# EAGLE schematic PCB1 (EAGLE 9.3.1)

## Sheet 1 of 4: Light Sensor
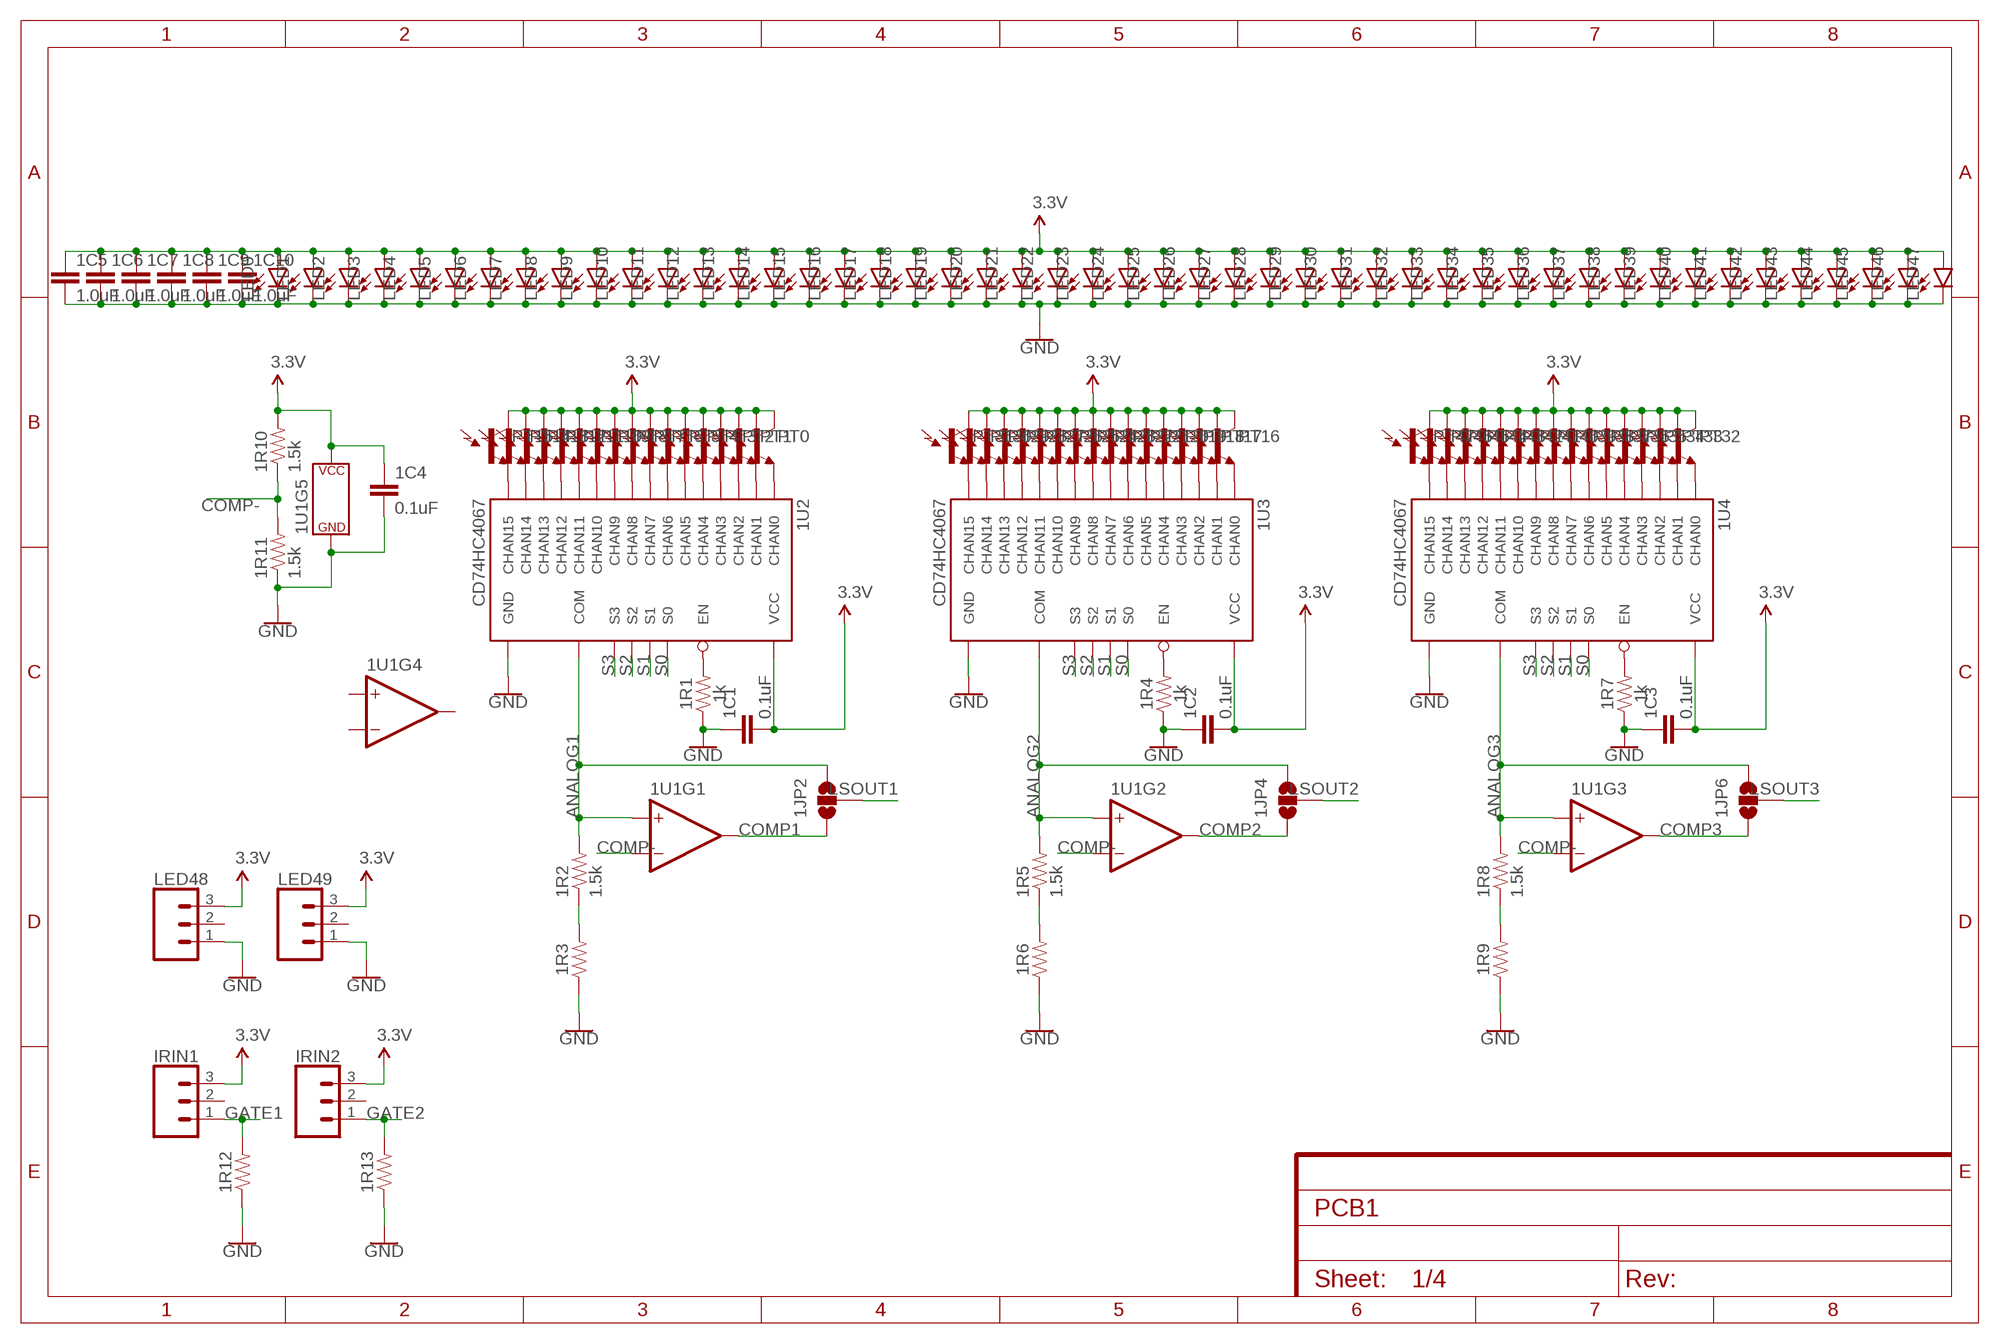
[diagram p0: schematic, sheet 1]

### Parts
1C1  0.1uF  0.1UF-0603-25V-5%  [0603]
1C2  0.1uF  0.1UF-0603-25V-5%  [0603]
1C3  0.1uF  0.1UF-0603-25V-5%  [0603]
1C4  0.1uF  0.1UF-0603-25V-5%  [0603]
1C5  1.0uF  1.0UF-0603-16V-10%-X7R  [0603]
1C6  1.0uF  1.0UF-0603-16V-10%-X7R  [0603]
1C7  1.0uF  1.0UF-0603-16V-10%-X7R  [0603]
1C8  1.0uF  1.0UF-0603-16V-10%-X7R  [0603]
1C9  1.0uF  1.0UF-0603-16V-10%-X7R  [0603]
1C10  1.0uF  1.0UF-0603-16V-10%-X7R  [0603]
1JP2  JUMPER-SMT_3_NO_NO_SILK  [SMT-JUMPER_3_0-NO_TRACE_NO-SILK]
1JP4  JUMPER-SMT_3_NO_NO_SILK  [SMT-JUMPER_3_0-NO_TRACE_NO-SILK]
1JP6  JUMPER-SMT_3_NO_NO_SILK  [SMT-JUMPER_3_0-NO_TRACE_NO-SILK]
1R1  1k  1KOHM-0603-1/10W-1%  [0603]
1R2  1.5k  1.5KOHM-0603-1/10W-1%  [0603]
1R3  RESISTOR0603  [0603]
1R4  1k  1KOHM-0603-1/10W-1%  [0603]
1R5  1.5k  1.5KOHM-0603-1/10W-1%  [0603]
1R6  RESISTOR0603  [0603]
1R7  1k  1KOHM-0603-1/10W-1%  [0603]
1R8  1.5k  1.5KOHM-0603-1/10W-1%  [0603]
1R9  RESISTOR0603  [0603]
1R10  1.5k  1.5KOHM-0603-1/10W-1%  [0603]
1R11  1.5k  1.5KOHM-0603-1/10W-1%  [0603]
1R12  RESISTOR0603  [0603]
1R13  RESISTOR0603  [0603]
1U1  LM339  [SOIC-14]
1U2  CD74HC4067  [SOIC-24]
1U3  CD74HC4067  [SOIC-24]
1U4  CD74HC4067  [SOIC-24]
IRIN1  CONN_03  [1X03]
IRIN2  CONN_03  [1X03]
LED0  3528LED  [3528]
LED1  3528LED  [3528]
LED2  3528LED  [3528]
LED3  3528LED  [3528]
LED4  3528LED  [3528]
LED5  3528LED  [3528]
LED6  3528LED  [3528]
LED7  3528LED  [3528]
LED8  3528LED  [3528]
LED9  3528LED  [3528]
LED10  3528LED  [3528]
LED11  3528LED  [3528]
LED12  3528LED  [3528]
LED13  3528LED  [3528]
LED14  3528LED  [3528]
LED15  3528LED  [3528]
LED16  3528LED  [3528]
LED17  3528LED  [3528]
LED18  3528LED  [3528]
LED19  3528LED  [3528]
LED20  3528LED  [3528]
LED21  3528LED  [3528]
LED22  3528LED  [3528]
LED23  3528LED  [3528]
LED24  3528LED  [3528]
LED25  3528LED  [3528]
LED26  3528LED  [3528]
LED27  3528LED  [3528]
LED28  3528LED  [3528]
LED29  3528LED  [3528]
LED30  3528LED  [3528]
LED31  3528LED  [3528]
LED32  3528LED  [3528]
LED33  3528LED  [3528]
LED34  3528LED  [3528]
LED35  3528LED  [3528]
LED36  3528LED  [3528]
LED37  3528LED  [3528]
LED38  3528LED  [3528]
LED39  3528LED  [3528]
LED40  3528LED  [3528]
LED41  3528LED  [3528]
LED42  3528LED  [3528]
LED43  3528LED  [3528]
LED44  3528LED  [3528]
LED45  3528LED  [3528]
LED46  3528LED  [3528]
LED47  3528LED  [3528]
LED48  CONN_03  [1X03]
LED49  CONN_03  [1X03]
PT0  TEMT6000  LIGHT_SENSORTEMT6000  [TEMT6000]
PT1  TEMT6000  LIGHT_SENSORTEMT6000  [TEMT6000]
PT2  TEMT6000  LIGHT_SENSORTEMT6000  [TEMT6000]
PT3  TEMT6000  LIGHT_SENSORTEMT6000  [TEMT6000]
PT4  TEMT6000  LIGHT_SENSORTEMT6000  [TEMT6000]
PT5  TEMT6000  LIGHT_SENSORTEMT6000  [TEMT6000]
PT6  TEMT6000  LIGHT_SENSORTEMT6000  [TEMT6000]
PT7  TEMT6000  LIGHT_SENSORTEMT6000  [TEMT6000]
PT8  TEMT6000  LIGHT_SENSORTEMT6000  [TEMT6000]
PT9  TEMT6000  LIGHT_SENSORTEMT6000  [TEMT6000]
PT10  TEMT6000  LIGHT_SENSORTEMT6000  [TEMT6000]
PT11  TEMT6000  LIGHT_SENSORTEMT6000  [TEMT6000]
PT12  TEMT6000  LIGHT_SENSORTEMT6000  [TEMT6000]
PT13  TEMT6000  LIGHT_SENSORTEMT6000  [TEMT6000]
PT14  TEMT6000  LIGHT_SENSORTEMT6000  [TEMT6000]
PT15  TEMT6000  LIGHT_SENSORTEMT6000  [TEMT6000]
PT16  TEMT6000  LIGHT_SENSORTEMT6000  [TEMT6000]
PT17  TEMT6000  LIGHT_SENSORTEMT6000  [TEMT6000]
PT18  TEMT6000  LIGHT_SENSORTEMT6000  [TEMT6000]
PT19  TEMT6000  LIGHT_SENSORTEMT6000  [TEMT6000]
PT20  TEMT6000  LIGHT_SENSORTEMT6000  [TEMT6000]
PT21  TEMT6000  LIGHT_SENSORTEMT6000  [TEMT6000]
PT22  TEMT6000  LIGHT_SENSORTEMT6000  [TEMT6000]
PT23  TEMT6000  LIGHT_SENSORTEMT6000  [TEMT6000]
PT24  TEMT6000  LIGHT_SENSORTEMT6000  [TEMT6000]
PT25  TEMT6000  LIGHT_SENSORTEMT6000  [TEMT6000]
PT26  TEMT6000  LIGHT_SENSORTEMT6000  [TEMT6000]
PT27  TEMT6000  LIGHT_SENSORTEMT6000  [TEMT6000]
PT28  TEMT6000  LIGHT_SENSORTEMT6000  [TEMT6000]
PT29  TEMT6000  LIGHT_SENSORTEMT6000  [TEMT6000]
PT30  TEMT6000  LIGHT_SENSORTEMT6000  [TEMT6000]
PT31  TEMT6000  LIGHT_SENSORTEMT6000  [TEMT6000]
PT32  TEMT6000  LIGHT_SENSORTEMT6000  [TEMT6000]
PT33  TEMT6000  LIGHT_SENSORTEMT6000  [TEMT6000]
PT34  TEMT6000  LIGHT_SENSORTEMT6000  [TEMT6000]
PT35  TEMT6000  LIGHT_SENSORTEMT6000  [TEMT6000]
PT36  TEMT6000  LIGHT_SENSORTEMT6000  [TEMT6000]
PT37  TEMT6000  LIGHT_SENSORTEMT6000  [TEMT6000]
PT38  TEMT6000  LIGHT_SENSORTEMT6000  [TEMT6000]
PT39  TEMT6000  LIGHT_SENSORTEMT6000  [TEMT6000]
PT40  TEMT6000  LIGHT_SENSORTEMT6000  [TEMT6000]
PT41  TEMT6000  LIGHT_SENSORTEMT6000  [TEMT6000]
PT42  TEMT6000  LIGHT_SENSORTEMT6000  [TEMT6000]
PT43  TEMT6000  LIGHT_SENSORTEMT6000  [TEMT6000]
PT44  TEMT6000  LIGHT_SENSORTEMT6000  [TEMT6000]
PT45  TEMT6000  LIGHT_SENSORTEMT6000  [TEMT6000]
PT46  TEMT6000  LIGHT_SENSORTEMT6000  [TEMT6000]
PT47  TEMT6000  LIGHT_SENSORTEMT6000  [TEMT6000]

### Nets
3.3V: 1C1.2 1C2.2 1C3.2 1C4.1 1C5.1 1C6.1 1C7.1 1C8.1 1C9.1 1C10.1 1R10.2 1U1.P3(P$V+) 1U2.P24(VCC) 1U3.P24(VCC) 1U4.P24(VCC) IRIN1.3 IRIN2.3 LED0.A LED1.A LED2.A LED3.A LED4.A LED5.A LED6.A LED7.A LED8.A LED9.A LED10.A LED11.A LED12.A LED13.A LED14.A LED15.A LED16.A LED17.A LED18.A LED19.A LED20.A LED21.A LED22.A LED23.A LED24.A LED25.A LED26.A LED27.A LED28.A LED29.A LED30.A LED31.A LED32.A LED33.A LED34.A LED35.A LED36.A LED37.A LED38.A LED39.A LED40.A LED41.A LED42.A LED43.A LED44.A LED45.A LED46.A LED47.A LED48.3 LED49.3 PT0.COLLECTOR(C1) PT1.COLLECTOR(C1) PT2.COLLECTOR(C1) PT3.COLLECTOR(C1) PT4.COLLECTOR(C1) PT5.COLLECTOR(C1) PT6.COLLECTOR(C1) PT7.COLLECTOR(C1) PT8.COLLECTOR(C1) PT9.COLLECTOR(C1) PT10.COLLECTOR(C1) PT11.COLLECTOR(C1) PT12.COLLECTOR(C1) PT13.COLLECTOR(C1) PT14.COLLECTOR(C1) PT15.COLLECTOR(C1) PT16.COLLECTOR(C1) PT17.COLLECTOR(C1) PT18.COLLECTOR(C1) PT19.COLLECTOR(C1) PT20.COLLECTOR(C1) PT21.COLLECTOR(C1) PT22.COLLECTOR(C1) PT23.COLLECTOR(C1) PT24.COLLECTOR(C1) PT25.COLLECTOR(C1) PT26.COLLECTOR(C1) PT27.COLLECTOR(C1) PT28.COLLECTOR(C1) PT29.COLLECTOR(C1) PT30.COLLECTOR(C1) PT31.COLLECTOR(C1) PT32.COLLECTOR(C1) PT33.COLLECTOR(C1) PT34.COLLECTOR(C1) PT35.COLLECTOR(C1) PT36.COLLECTOR(C1) PT37.COLLECTOR(C1) PT38.COLLECTOR(C1) PT39.COLLECTOR(C1) PT40.COLLECTOR(C1) PT41.COLLECTOR(C1) PT42.COLLECTOR(C1) PT43.COLLECTOR(C1) PT44.COLLECTOR(C1) PT45.COLLECTOR(C1) PT46.COLLECTOR(C1) PT47.COLLECTOR(C1) ; also sheet 2,3,4
ANALOG1: 1JP2.3 1R2.2 1U1.P5(+IN) 1U2.P1(COM)
ANALOG2: 1JP4.3 1R5.2 1U1.P7(+IN) 1U3.P1(COM)
ANALOG3: 1JP6.3 1R8.2 1U1.P9(+IN) 1U4.P1(COM)
COMP1: 1JP2.1 1U1.P2(OUT)
COMP2: 1JP4.1 1U1.P1(OUT)
COMP3: 1JP6.1 1U1.P14(OUT)
COMP-: 1R10.1 1R11.2 1U1.P4(-IN) 1U1.P6(-IN) 1U1.P8(-IN)
GATE1: 1R12.2 IRIN1.1 ; also sheet 4
GATE2: 1R13.2 IRIN2.1 ; also sheet 4
GND: 1C1.1 1C2.1 1C3.1 1C4.2 1C5.2 1C6.2 1C7.2 1C8.2 1C9.2 1C10.2 1R1.1 1R3.1 1R4.1 1R6.1 1R7.1 1R9.1 1R11.1 1R12.1 1R13.1 1U1.P12(P$V-) 1U2.P12(GND) 1U3.P12(GND) 1U4.P12(GND) LED0.C LED1.C LED2.C LED3.C LED4.C LED5.C LED6.C LED7.C LED8.C LED9.C LED10.C LED11.C LED12.C LED13.C LED14.C LED15.C LED16.C LED17.C LED18.C LED19.C LED20.C LED21.C LED22.C LED23.C LED24.C LED25.C LED26.C LED27.C LED28.C LED29.C LED30.C LED31.C LED32.C LED33.C LED34.C LED35.C LED36.C LED37.C LED38.C LED39.C LED40.C LED41.C LED42.C LED43.C LED44.C LED45.C LED46.C LED47.C LED48.1 LED49.1 ; also sheet 2,3,4
LSOUT1: 1JP2.2 ; also sheet 4
LSOUT2: 1JP4.2 ; also sheet 4
LSOUT3: 1JP6.2 ; also sheet 4
N$1: 1U2.P9(CHAN0) PT0.EMITTER(E1)
N$50: 1R1.2 1U2.P15(EN)
N$51: 1U2.P8(CHAN1) PT1.EMITTER(E1)
N$52: 1U2.P7(CHAN2) PT2.EMITTER(E1)
N$53: 1U2.P6(CHAN3) PT3.EMITTER(E1)
N$54: 1U2.P5(CHAN4) PT4.EMITTER(E1)
N$55: 1U2.P4(CHAN5) PT5.EMITTER(E1)
N$56: 1U2.P3(CHAN6) PT6.EMITTER(E1)
N$57: 1U2.P2(CHAN7) PT7.EMITTER(E1)
N$58: 1U2.P23(CHAN8) PT8.EMITTER(E1)
N$59: 1U2.P22(CHAN9) PT9.EMITTER(E1)
N$60: 1U2.P21(CHAN10) PT10.EMITTER(E1)
N$61: 1U2.P20(CHAN11) PT11.EMITTER(E1)
N$62: 1U2.P19(CHAN12) PT12.EMITTER(E1)
N$63: 1U2.P18(CHAN13) PT13.EMITTER(E1)
N$64: 1U2.P17(CHAN14) PT14.EMITTER(E1)
N$65: 1U2.P16(CHAN15) PT15.EMITTER(E1)
N$66: 1R4.2 1U3.P15(EN)
N$67: 1R2.1 1R3.2
N$68: 1U3.P9(CHAN0) PT16.EMITTER(E1)
N$69: 1U3.P8(CHAN1) PT17.EMITTER(E1)
N$70: 1R5.1 1R6.2
N$71: 1U3.P7(CHAN2) PT18.EMITTER(E1)
N$72: 1U3.P6(CHAN3) PT19.EMITTER(E1)
N$73: 1U3.P5(CHAN4) PT20.EMITTER(E1)
N$74: 1U3.P4(CHAN5) PT21.EMITTER(E1)
N$75: 1U3.P3(CHAN6) PT22.EMITTER(E1)
N$76: 1U3.P2(CHAN7) PT23.EMITTER(E1)
N$77: 1U3.P23(CHAN8) PT24.EMITTER(E1)
N$78: 1U3.P22(CHAN9) PT25.EMITTER(E1)
N$79: 1U3.P21(CHAN10) PT26.EMITTER(E1)
N$80: 1U3.P20(CHAN11) PT27.EMITTER(E1)
N$81: 1U3.P19(CHAN12) PT28.EMITTER(E1)
N$82: 1U3.P18(CHAN13) PT29.EMITTER(E1)
N$83: 1U3.P17(CHAN14) PT30.EMITTER(E1)
N$84: 1U3.P16(CHAN15) PT31.EMITTER(E1)
N$85: 1U4.P9(CHAN0) PT32.EMITTER(E1)
N$86: 1U4.P8(CHAN1) PT33.EMITTER(E1)
N$87: 1R7.2 1U4.P15(EN)
N$88: 1R8.1 1R9.2
N$89: 1U4.P7(CHAN2) PT34.EMITTER(E1)
N$90: 1U4.P6(CHAN3) PT35.EMITTER(E1)
N$91: 1U4.P5(CHAN4) PT36.EMITTER(E1)
N$92: 1U4.P4(CHAN5) PT37.EMITTER(E1)
N$93: 1U4.P3(CHAN6) PT38.EMITTER(E1)
N$94: 1U4.P2(CHAN7) PT39.EMITTER(E1)
N$95: 1U4.P23(CHAN8) PT40.EMITTER(E1)
N$96: 1U4.P22(CHAN9) PT41.EMITTER(E1)
N$97: 1U4.P21(CHAN10) PT42.EMITTER(E1)
N$98: 1U4.P20(CHAN11) PT43.EMITTER(E1)
N$99: 1U4.P19(CHAN12) PT44.EMITTER(E1)
N$100: 1U4.P18(CHAN13) PT45.EMITTER(E1)
N$101: 1U4.P17(CHAN14) PT46.EMITTER(E1)
N$102: 1U4.P16(CHAN15) PT47.EMITTER(E1)
S0: 1U2.P10(S0) 1U3.P10(S0) 1U4.P10(S0) ; also sheet 4
S1: 1U2.P11(S1) 1U3.P11(S1) 1U4.P11(S1) ; also sheet 4
S2: 1U2.P14(S2) 1U3.P14(S2) 1U4.P14(S2) ; also sheet 4
S3: 1U2.P13(S3) 1U3.P13(S3) 1U4.P13(S3) ; also sheet 4
Unconnected: 1U1.P10(-IN) 1U1.P11(+IN) 1U1.P13(OUT) IRIN1.2 IRIN2.2 LED48.2 LED49.2

## Sheet 2 of 4: Motor Driver
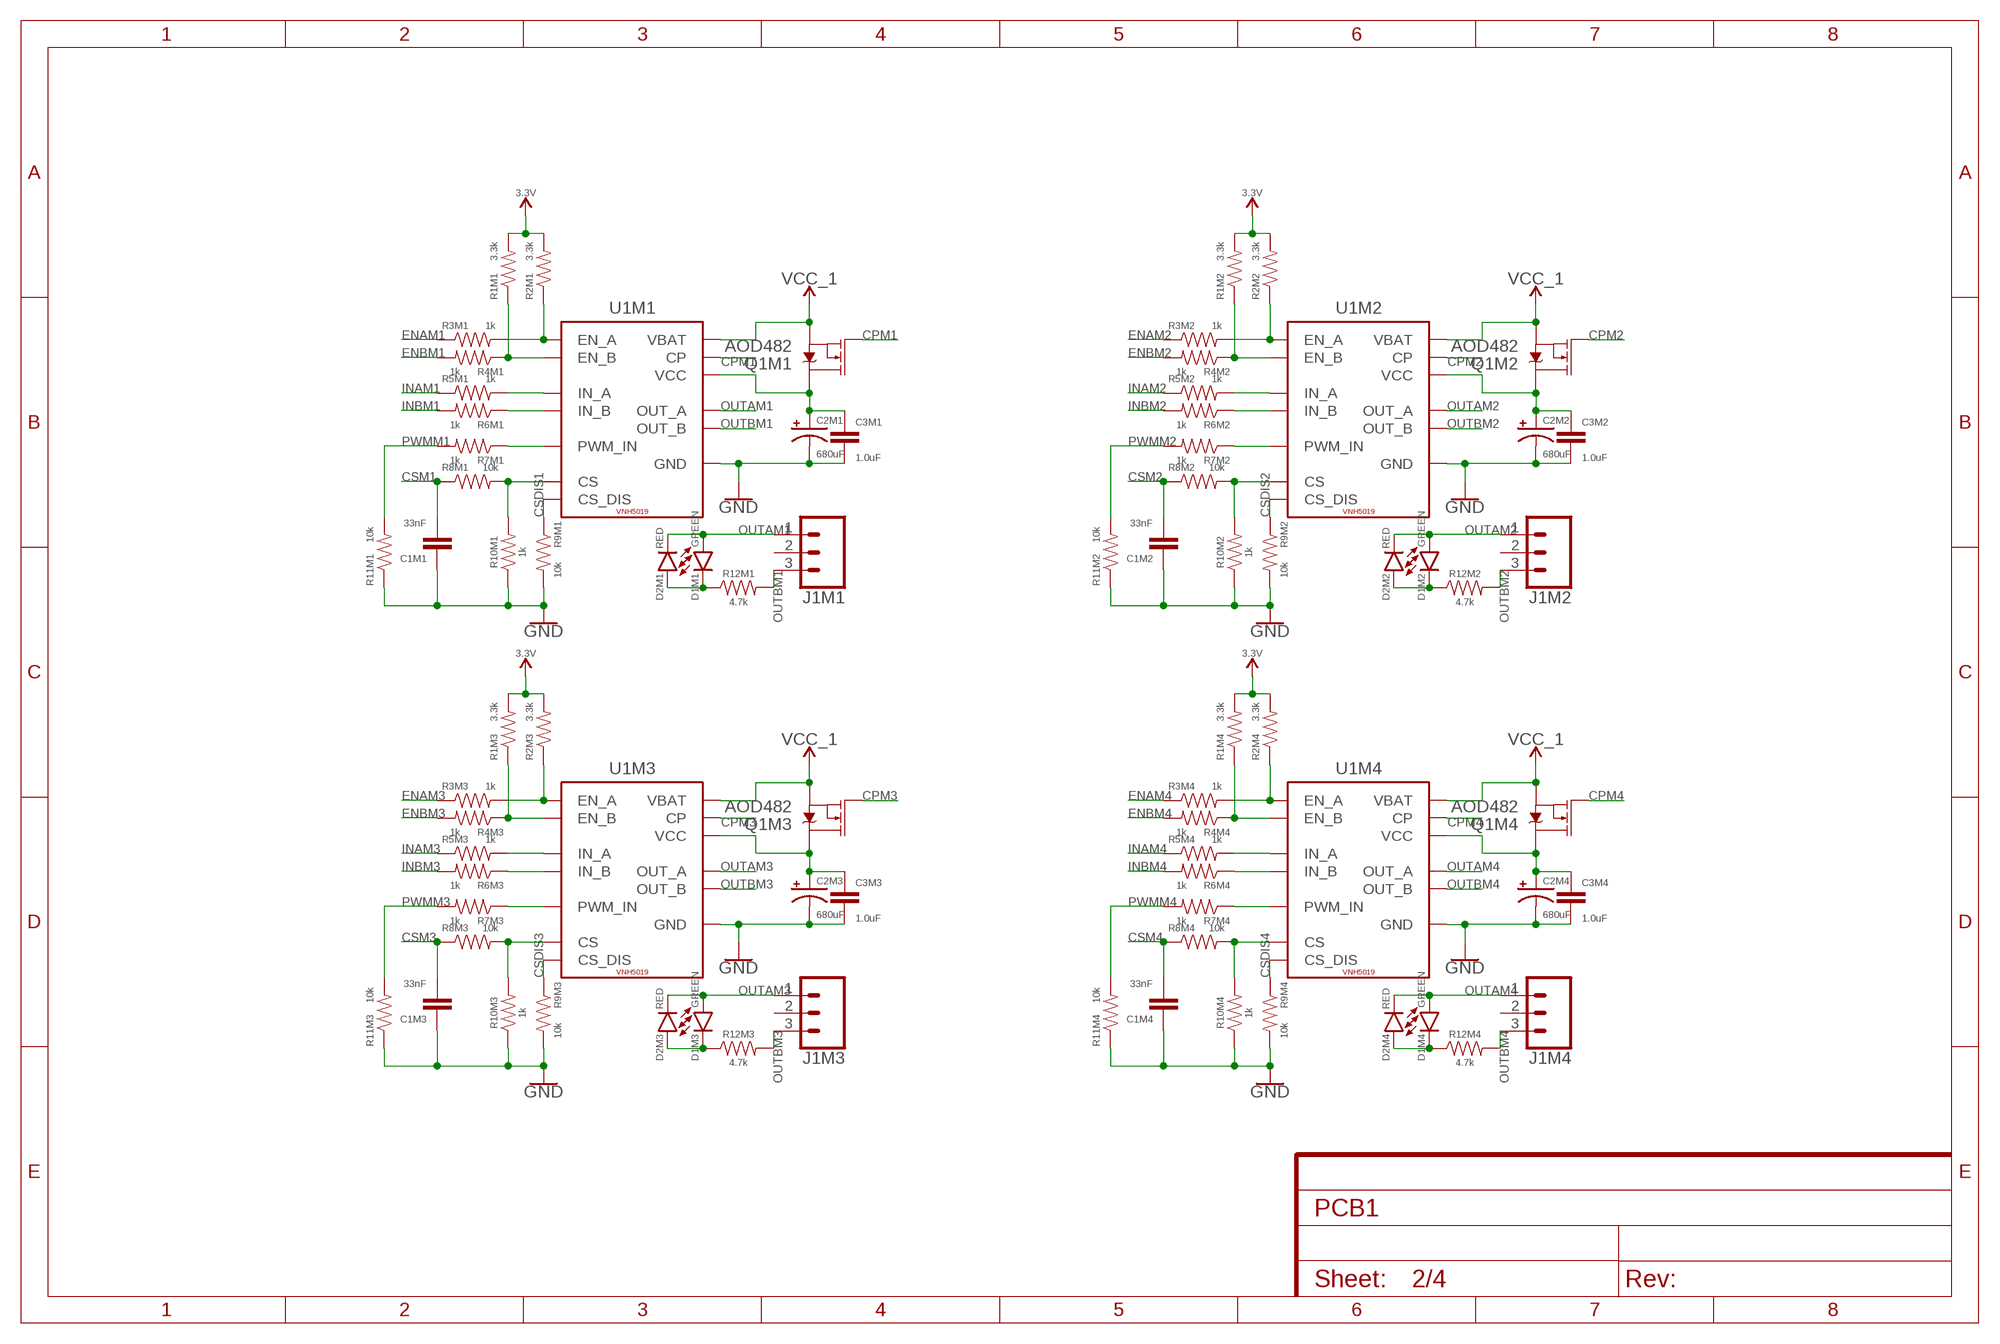
[diagram p1: schematic, sheet 2]

### Parts
C1M1  33nF  33NF-0603-50V-10%  [0603]
C1M2  33nF  33NF-0603-50V-10%  [0603]
C1M3  33nF  33NF-0603-50V-10%  [0603]
C1M4  33nF  33NF-0603-50V-10%  [0603]
C2M1  680uF  CPOL-USE3.5-8  [E3,5-8]
C2M2  680uF  CPOL-USE3.5-8  [E3,5-8]
C2M3  680uF  CPOL-USE3.5-8  [E3,5-8]
C2M4  680uF  CPOL-USE3.5-8  [E3,5-8]
C3M1  1.0uF  1.0UF-0603-16V-10%-X7R  [0603]
C3M2  1.0uF  1.0UF-0603-16V-10%-X7R  [0603]
C3M3  1.0uF  1.0UF-0603-16V-10%-X7R  [0603]
C3M4  1.0uF  1.0UF-0603-16V-10%-X7R  [0603]
D1M1  GREEN  LED-GREEN0603  [LED-0603]
D1M2  GREEN  LED-GREEN0603  [LED-0603]
D1M3  GREEN  LED-GREEN0603  [LED-0603]
D1M4  GREEN  LED-GREEN0603  [LED-0603]
D2M1  RED  LED-RED0603  [LED-0603]
D2M2  RED  LED-RED0603  [LED-0603]
D2M3  RED  LED-RED0603  [LED-0603]
D2M4  RED  LED-RED0603  [LED-0603]
J1M1  CONN_03-SCREW-5MM  [SCREWTERMINAL-5MM-3]
J1M2  CONN_03-SCREW-5MM  [SCREWTERMINAL-5MM-3]
J1M3  CONN_03-SCREW-5MM  [SCREWTERMINAL-5MM-3]
J1M4  CONN_03-SCREW-5MM  [SCREWTERMINAL-5MM-3]
Q1M1  AOD482  MOSFET-NCH-FDD8780  [DPAK]
Q1M2  AOD482  MOSFET-NCH-FDD8780  [DPAK]
Q1M3  AOD482  MOSFET-NCH-FDD8780  [DPAK]
Q1M4  AOD482  MOSFET-NCH-FDD8780  [DPAK]
R1M1  3.3k  3.3KOHM-0603-1/10W-1%  [0603]
R1M2  3.3k  3.3KOHM-0603-1/10W-1%  [0603]
R1M3  3.3k  3.3KOHM-0603-1/10W-1%  [0603]
R1M4  3.3k  3.3KOHM-0603-1/10W-1%  [0603]
R2M1  3.3k  3.3KOHM-0603-1/10W-1%  [0603]
R2M2  3.3k  3.3KOHM-0603-1/10W-1%  [0603]
R2M3  3.3k  3.3KOHM-0603-1/10W-1%  [0603]
R2M4  3.3k  3.3KOHM-0603-1/10W-1%  [0603]
R3M1  1k  1KOHM-0603-1/10W-1%  [0603]
R3M2  1k  1KOHM-0603-1/10W-1%  [0603]
R3M3  1k  1KOHM-0603-1/10W-1%  [0603]
R3M4  1k  1KOHM-0603-1/10W-1%  [0603]
R4M1  1k  1KOHM-0603-1/10W-1%  [0603]
R4M2  1k  1KOHM-0603-1/10W-1%  [0603]
R4M3  1k  1KOHM-0603-1/10W-1%  [0603]
R4M4  1k  1KOHM-0603-1/10W-1%  [0603]
R5M1  1k  1KOHM-0603-1/10W-1%  [0603]
R5M2  1k  1KOHM-0603-1/10W-1%  [0603]
R5M3  1k  1KOHM-0603-1/10W-1%  [0603]
R5M4  1k  1KOHM-0603-1/10W-1%  [0603]
R6M1  1k  1KOHM-0603-1/10W-1%  [0603]
R6M2  1k  1KOHM-0603-1/10W-1%  [0603]
R6M3  1k  1KOHM-0603-1/10W-1%  [0603]
R6M4  1k  1KOHM-0603-1/10W-1%  [0603]
R7M1  1k  1KOHM-0603-1/10W-1%  [0603]
R7M2  1k  1KOHM-0603-1/10W-1%  [0603]
R7M3  1k  1KOHM-0603-1/10W-1%  [0603]
R7M4  1k  1KOHM-0603-1/10W-1%  [0603]
R8M1  10k  10KOHM-0603-1/10W-1%  [0603]
R8M2  10k  10KOHM-0603-1/10W-1%  [0603]
R8M3  10k  10KOHM-0603-1/10W-1%  [0603]
R8M4  10k  10KOHM-0603-1/10W-1%  [0603]
R9M1  10k  10KOHM-0603-1/10W-1%  [0603]
R9M2  10k  10KOHM-0603-1/10W-1%  [0603]
R9M3  10k  10KOHM-0603-1/10W-1%  [0603]
R9M4  10k  10KOHM-0603-1/10W-1%  [0603]
R10M1  1k  1KOHM-0603-1/10W-1%  [0603]
R10M2  1k  1KOHM-0603-1/10W-1%  [0603]
R10M3  1k  1KOHM-0603-1/10W-1%  [0603]
R10M4  1k  1KOHM-0603-1/10W-1%  [0603]
R11M1  10k  10KOHM-0603-1/10W-1%  [0603]
R11M2  10k  10KOHM-0603-1/10W-1%  [0603]
R11M3  10k  10KOHM-0603-1/10W-1%  [0603]
R11M4  10k  10KOHM-0603-1/10W-1%  [0603]
R12M1  4.7k  4.7KOHM-0603-1/10W-1%  [0603]
R12M2  4.7k  4.7KOHM-0603-1/10W-1%  [0603]
R12M3  4.7k  4.7KOHM-0603-1/10W-1%  [0603]
R12M4  4.7k  4.7KOHM-0603-1/10W-1%  [0603]
U1M1  VNH5019  [POWERSO-30]
U1M2  VNH5019  [POWERSO-30]
U1M3  VNH5019  [POWERSO-30]
U1M4  VNH5019  [POWERSO-30]

### Nets
3.3V: R1M1.2 R1M2.2 R1M3.2 R1M4.2 R2M1.2 R2M2.2 R2M3.2 R2M4.2 ; also sheet 1,3,4
CPM1: Q1M1.1(G) U1M1.P11(CP)
CPM2: Q1M2.1(G) U1M2.P11(CP)
CPM3: Q1M3.1(G) U1M3.P11(CP)
CPM4: Q1M4.1(G) U1M4.P11(CP)
CSDIS1: R9M1.1 U1M1.P6(CS_DIS)
CSDIS2: R9M2.1 U1M2.P6(CS_DIS)
CSDIS3: R9M3.1 U1M3.P6(CS_DIS)
CSDIS4: R9M4.1 U1M4.P6(CS_DIS)
CSM1: C1M1.2 R8M1.1 ; also sheet 4
CSM2: C1M2.2 R8M2.1 ; also sheet 4
CSM3: C1M3.2 R8M3.1 ; also sheet 4
CSM4: C1M4.2 R8M4.1 ; also sheet 4
ENAM1: R3M1.1
ENAM2: R3M2.1
ENAM3: R3M3.1
ENAM4: R3M4.1
ENBM1: R4M1.2
ENBM2: R4M2.2
ENBM3: R4M3.2
ENBM4: R4M4.2
GND: C1M1.1 C1M2.1 C1M3.1 C1M4.1 C2M1.- C2M2.- C2M3.- C2M4.- C3M1.2 C3M2.2 C3M3.2 C3M4.2 R9M1.2 R9M2.2 R9M3.2 R9M4.2 R10M1.1 R10M2.1 R10M3.1 R10M4.1 R11M1.1 R11M2.1 R11M3.1 R11M4.1 U1M1.P18(GND) U1M1.P19(GND) U1M1.P20(GND) U1M1.P26(GND) U1M1.P27(GND) U1M1.P28(GND) U1M2.P18(GND) U1M2.P19(GND) U1M2.P20(GND) U1M2.P26(GND) U1M2.P27(GND) U1M2.P28(GND) U1M3.P18(GND) U1M3.P19(GND) U1M3.P20(GND) U1M3.P26(GND) U1M3.P27(GND) U1M3.P28(GND) U1M4.P18(GND) U1M4.P19(GND) U1M4.P20(GND) U1M4.P26(GND) U1M4.P27(GND) U1M4.P28(GND) ; also sheet 1,3,4
INAM1: R5M1.1 ; also sheet 4
INAM2: R5M2.1 ; also sheet 4
INAM3: R5M3.1 ; also sheet 4
INAM4: R5M4.1 ; also sheet 4
INBM1: R6M1.2 ; also sheet 4
INBM2: R6M2.2 ; also sheet 4
INBM3: R6M3.2 ; also sheet 4
INBM4: R6M4.2 ; also sheet 4
N$2: R2M1.1 R3M1.2 U1M1.P5(EN_A)
N$3: C2M1.+ C3M1.1 Q1M1.4(D) U1M1.P3(VCC) U1M1.P13(VCC) U1M1.P23(VCC) U1M1.SLUG1(VCC)
N$4: R1M1.1 R4M1.1 U1M1.P9(EN_B)
N$5: R6M1.1 U1M1.P10(IN_B)
N$6: R5M1.2 U1M1.P4(IN_A)
N$7: R8M1.2 R10M1.2 U1M1.P8(CS)
N$8: R7M1.1 U1M1.P7(PWM_IN)
N$9: C2M2.+ C3M2.1 Q1M2.4(D) U1M2.P3(VCC) U1M2.P13(VCC) U1M2.P23(VCC) U1M2.SLUG1(VCC)
N$10: R2M2.1 R3M2.2 U1M2.P5(EN_A)
N$11: R5M2.2 U1M2.P4(IN_A)
N$12: D1M1.C D2M1.A R12M1.1
N$13: R1M2.1 R4M2.1 U1M2.P9(EN_B)
N$14: R6M2.1 U1M2.P10(IN_B)
N$15: R8M2.2 R10M2.2 U1M2.P8(CS)
N$16: R7M2.1 U1M2.P7(PWM_IN)
N$17: D1M2.C D2M2.A R12M2.1
N$18: C2M3.+ C3M3.1 Q1M3.4(D) U1M3.P3(VCC) U1M3.P13(VCC) U1M3.P23(VCC) U1M3.SLUG1(VCC)
N$19: R2M3.1 R3M3.2 U1M3.P5(EN_A)
N$20: R5M3.2 U1M3.P4(IN_A)
N$21: R1M3.1 R4M3.1 U1M3.P9(EN_B)
N$22: R6M3.1 U1M3.P10(IN_B)
N$23: R8M3.2 R10M3.2 U1M3.P8(CS)
N$24: R7M3.1 U1M3.P7(PWM_IN)
N$25: D1M3.C D2M3.A R12M3.1
N$26: C2M4.+ C3M4.1 Q1M4.4(D) U1M4.P3(VCC) U1M4.P13(VCC) U1M4.P23(VCC) U1M4.SLUG1(VCC)
N$27: R2M4.1 R3M4.2 U1M4.P5(EN_A)
N$28: R5M4.2 U1M4.P4(IN_A)
N$29: R1M4.1 R4M4.1 U1M4.P9(EN_B)
N$30: R6M4.1 U1M4.P10(IN_B)
N$31: R8M4.2 R10M4.2 U1M4.P8(CS)
N$32: R7M4.1 U1M4.P7(PWM_IN)
N$33: D1M4.C D2M4.A R12M4.1
OUTAM1: D1M1.A D2M1.C J1M1.1 U1M1.P1(OUT_A) U1M1.P25(OUT_A) U1M1.P30(OUT_A) U1M1.SLUG2(OUT_A)
OUTAM2: D1M2.A D2M2.C J1M2.1 U1M2.P1(OUT_A) U1M2.P25(OUT_A) U1M2.P30(OUT_A) U1M2.SLUG2(OUT_A)
OUTAM3: D1M3.A D2M3.C J1M3.1 U1M3.P1(OUT_A) U1M3.P25(OUT_A) U1M3.P30(OUT_A) U1M3.SLUG2(OUT_A)
OUTAM4: D1M4.A D2M4.C J1M4.1 U1M4.P1(OUT_A) U1M4.P25(OUT_A) U1M4.P30(OUT_A) U1M4.SLUG2(OUT_A)
OUTBM1: J1M1.3 R12M1.2 U1M1.P15(OUT_B) U1M1.P16(OUT_B) U1M1.P21(OUT_B) U1M1.SLUG3(OUT_B)
OUTBM2: J1M2.3 R12M2.2 U1M2.P15(OUT_B) U1M2.P16(OUT_B) U1M2.P21(OUT_B) U1M2.SLUG3(OUT_B)
OUTBM3: J1M3.3 R12M3.2 U1M3.P15(OUT_B) U1M3.P16(OUT_B) U1M3.P21(OUT_B) U1M3.SLUG3(OUT_B)
OUTBM4: J1M4.3 R12M4.2 U1M4.P15(OUT_B) U1M4.P16(OUT_B) U1M4.P21(OUT_B) U1M4.SLUG3(OUT_B)
PWMM1: R7M1.2 R11M1.2 ; also sheet 4
PWMM2: R7M2.2 R11M2.2 ; also sheet 4
PWMM3: R7M3.2 R11M3.2 ; also sheet 4
PWMM4: R7M4.2 R11M4.2 ; also sheet 4
VCC_1: Q1M1.3(S) Q1M2.3(S) Q1M3.3(S) Q1M4.3(S) U1M1.P12(VBAT) U1M2.P12(VBAT) U1M3.P12(VBAT) U1M4.P12(VBAT) ; also sheet 4
Unconnected: J1M1.2 J1M2.2 J1M3.2 J1M4.2 U1M1.P2(NC) U1M1.P14(NC) U1M1.P17(NC) U1M1.P22(NC) U1M1.P24(NC) U1M1.P29(NC) U1M2.P2(NC) U1M2.P14(NC) U1M2.P17(NC) U1M2.P22(NC) U1M2.P24(NC) U1M2.P29(NC) U1M3.P2(NC) U1M3.P14(NC) U1M3.P17(NC) U1M3.P22(NC) U1M3.P24(NC) U1M3.P29(NC) U1M4.P2(NC) U1M4.P14(NC) U1M4.P17(NC) U1M4.P22(NC) U1M4.P24(NC) U1M4.P29(NC)

## Sheet 3 of 4: Boost & Step Down
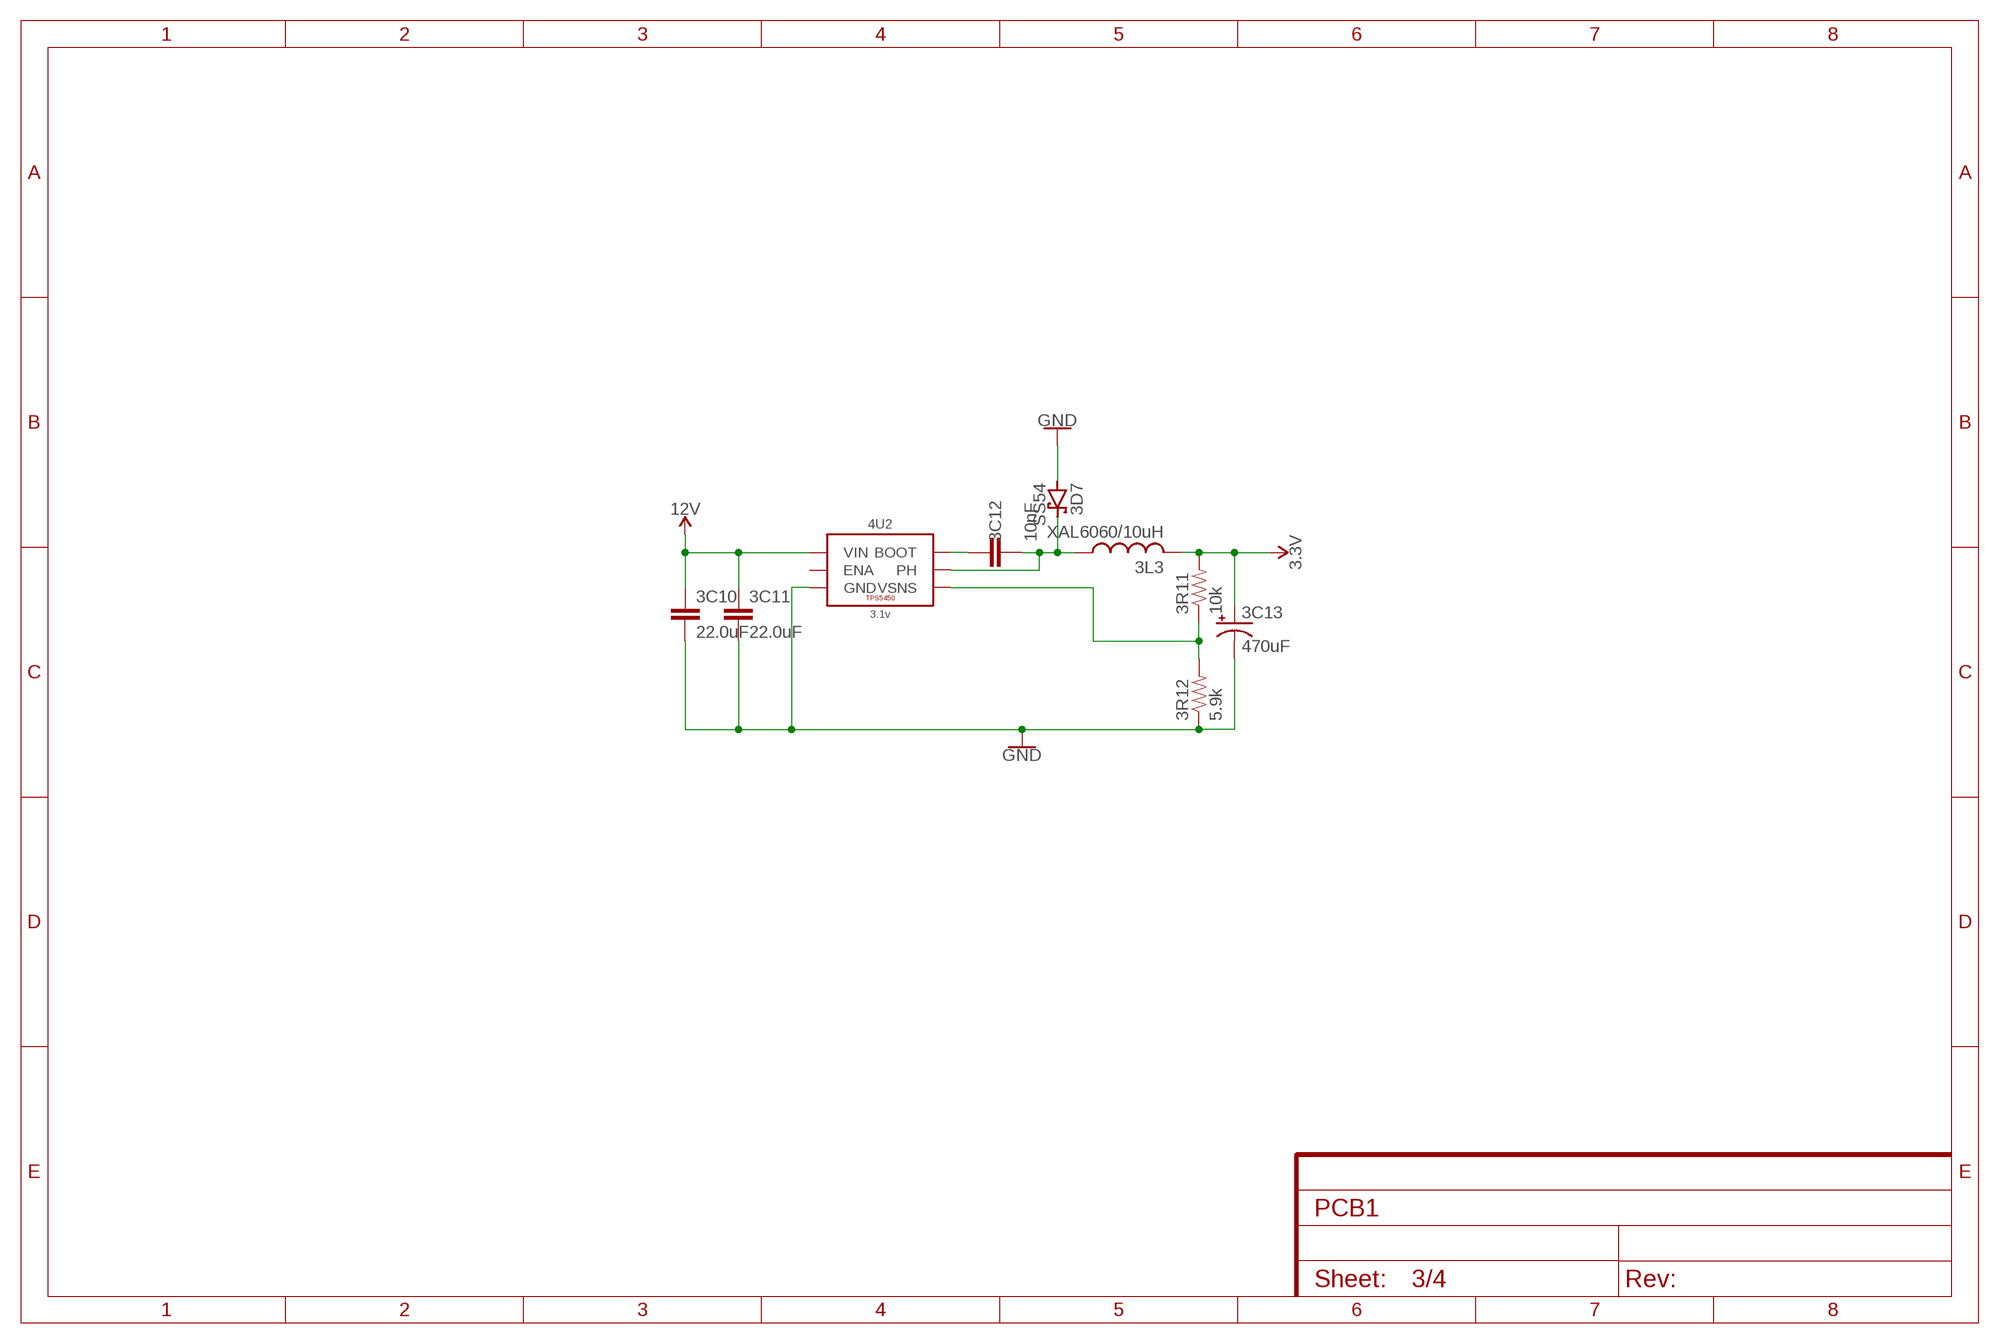
[diagram p2: schematic, sheet 3]

### Parts
3C10  22.0uF  22UF-1210-16V-20%  [1210]
3C11  22.0uF  22UF-1210-16V-20%  [1210]
3C12  10nF  10NF-0603-50V-10%  [0603]
3C13  470uF  CPOL-USD/7343-31R  [D/7343-31R]
3D7  SS54  SCHOTTKY-DIODESMD  [SMB]
3L3  XAL6060/10uH  XAL6060  [XAL6060]
3R11  10k  10KOHM-0603-1/10W-1%  [0603]
3R12  5.9k  5.62KOHM-0603-1/10W-1%  [0603]
4U2  3.1v  TPS5450  [POWERPAD-SOIC-8]

### Nets
3.3V: 3C13.+ 3L3.2 3R11.2 ; also sheet 1,2,4
12V: 3C10.1 3C11.1 4U2.7(VIN) ; also sheet 4
GND: 3C10.2 3C11.2 3C13.- 3D7.A 3R12.1 4U2.6(GND) 4U2.9(GND) 4U2.P$1(GND) 4U2.P$2(GND) 4U2.P$3(GND) 4U2.P$4(GND) 4U2.P$5(GND) 4U2.P$6(GND) ; also sheet 1,2,4
N$46: 3C12.1 4U2.1(BOOT)
N$48: 3C12.2 3D7.C 3L3.1 4U2.8(PH)
N$49: 3R11.1 3R12.2 4U2.4(VSNS)
Unconnected: 4U2.2(NC) 4U2.3(NC) 4U2.5(ENA)

## Sheet 4 of 4: Connectors
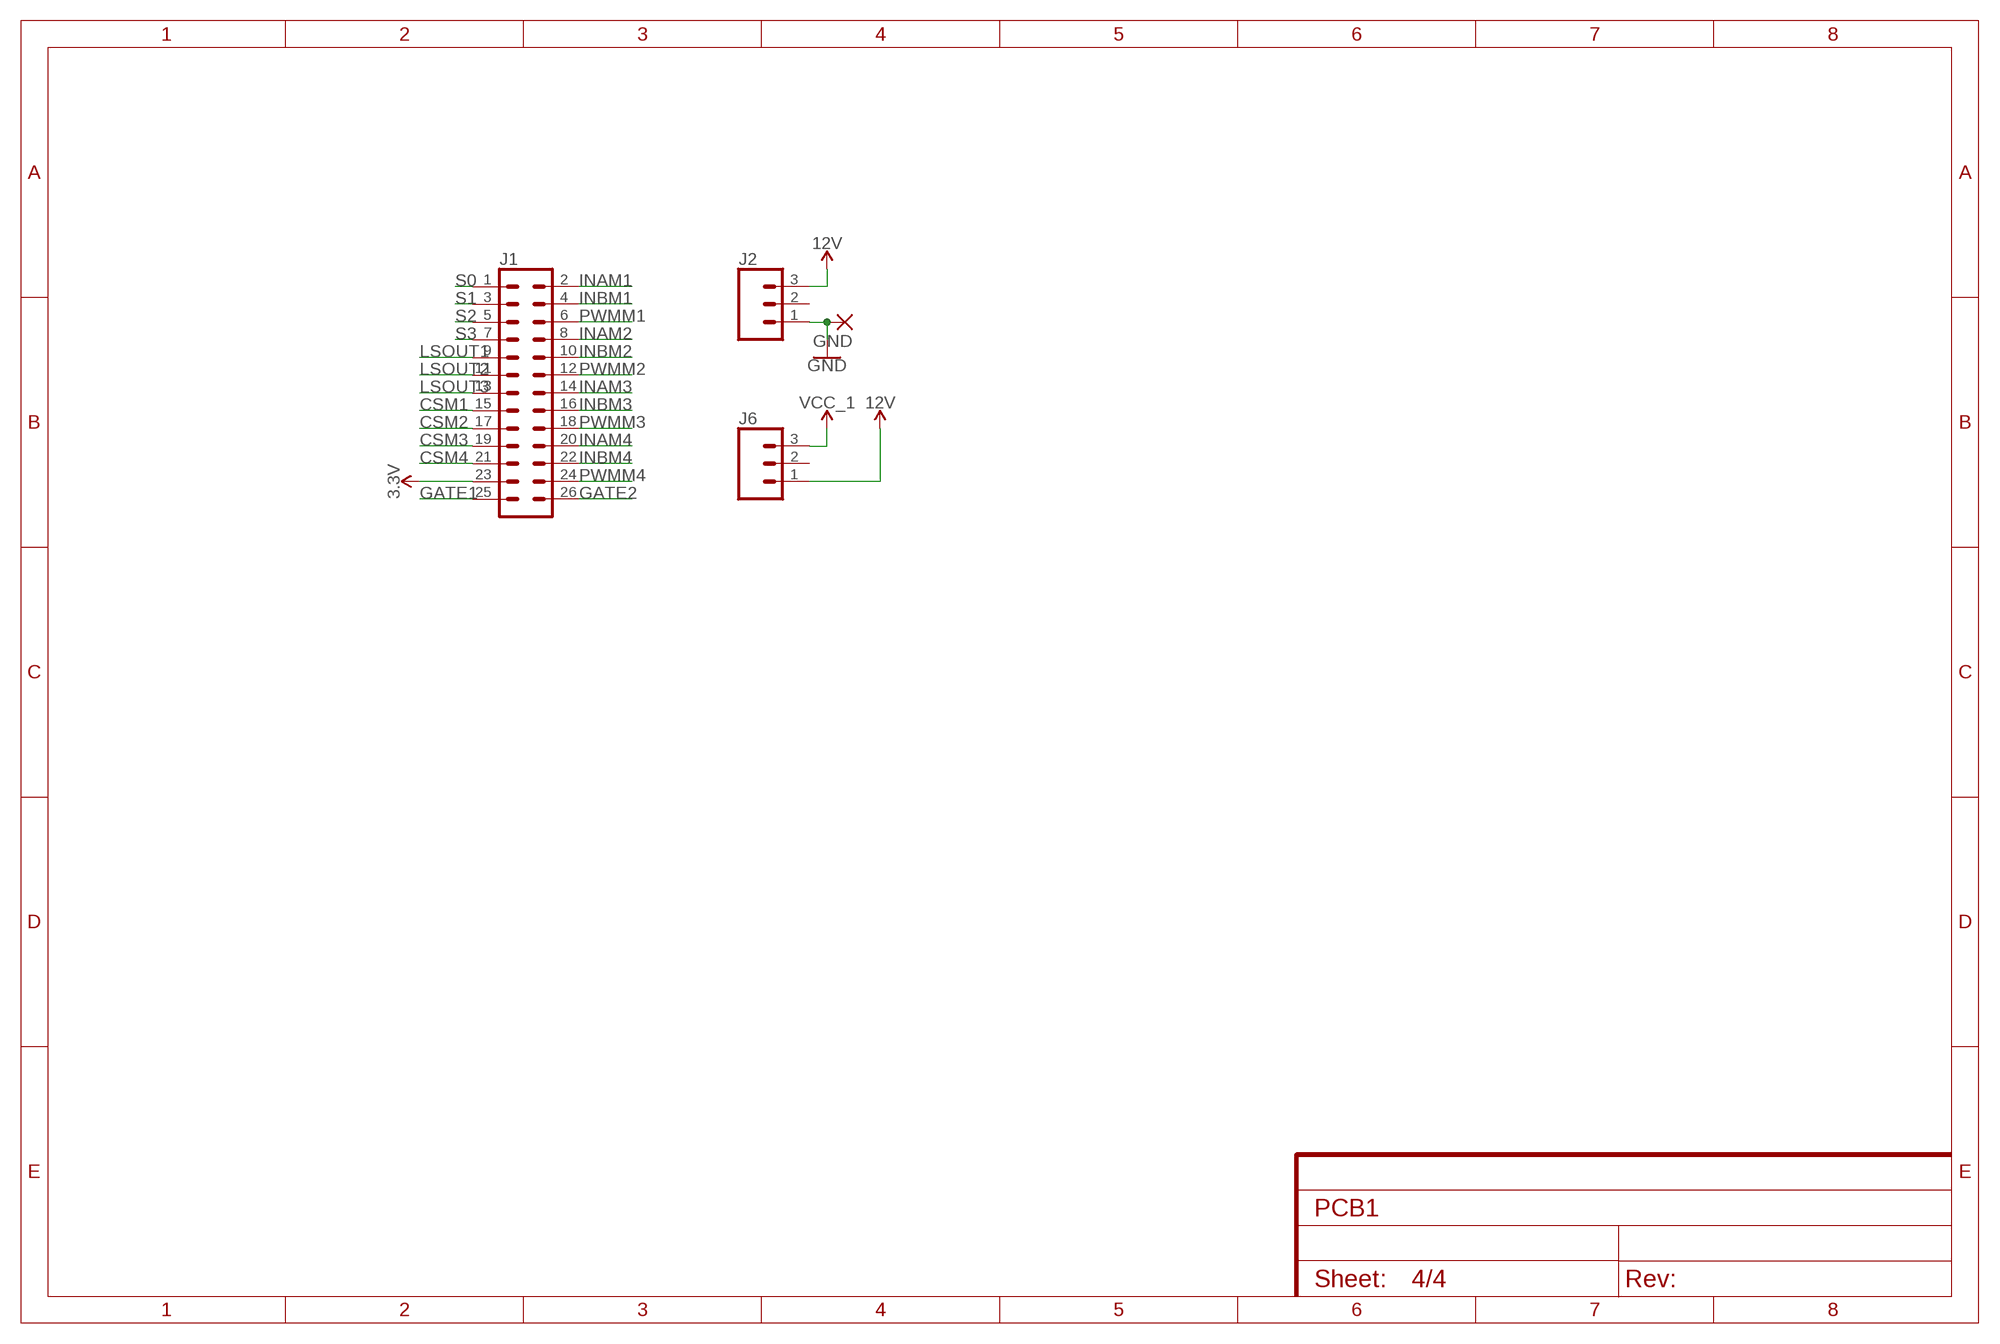
[diagram p3: schematic, sheet 4]

### Parts
GND  3,17/1,1  [3,17/1,1]
J1  CONN_13X22X13  [2X13]
J2  CONN_03-SCREW-5MM  [SCREWTERMINAL-5MM-3]
J6  CONN_03-SCREW-5MM  [SCREWTERMINAL-5MM-3]

### Nets
3.3V: J1.23 ; also sheet 1,2,3
12V: J2.3 J6.1 ; also sheet 3
CSM1: J1.15 ; also sheet 2
CSM2: J1.17 ; also sheet 2
CSM3: J1.19 ; also sheet 2
CSM4: J1.21 ; also sheet 2
GATE1: J1.25 ; also sheet 1
GATE2: J1.26 ; also sheet 1
GND: GND.1(P) J2.1 ; also sheet 1,2,3
INAM1: J1.2 ; also sheet 2
INAM2: J1.8 ; also sheet 2
INAM3: J1.14 ; also sheet 2
INAM4: J1.20 ; also sheet 2
INBM1: J1.4 ; also sheet 2
INBM2: J1.10 ; also sheet 2
INBM3: J1.16 ; also sheet 2
INBM4: J1.22 ; also sheet 2
LSOUT1: J1.9 ; also sheet 1
LSOUT2: J1.11 ; also sheet 1
LSOUT3: J1.13 ; also sheet 1
PWMM1: J1.6 ; also sheet 2
PWMM2: J1.12 ; also sheet 2
PWMM3: J1.18 ; also sheet 2
PWMM4: J1.24 ; also sheet 2
S0: J1.1 ; also sheet 1
S1: J1.3 ; also sheet 1
S2: J1.5 ; also sheet 1
S3: J1.7 ; also sheet 1
VCC_1: J6.3 ; also sheet 2
Unconnected: J2.2 J6.2

## Library data of the parts
1C1-1C4 = SparkFun-Capacitors:0.1UF: 0.1µF ceramic capacitors A capacitor is a passive two-terminal electrical component used to store electrical energy temporarily in an electric field.; PROD_ID: CAP-08604
1C5-1C10 C3M1-C3M4 = SparkFun-Capacitors:1.0UF: 1µF ceramic capacitors A capacitor is a passive two-terminal electrical component used to store electrical energy temporarily in an electric field.; PROD_ID: CAP-13930
1JP2 1JP4 1JP6 = SparkFun-Jumpers:JUMPER-SMT_3_NO: Normally open jumper This jumper has three pads in close proximity to each other. Apply solder to close the connection(s).
1R1 1R4 1R7 R3M1-R3M4 R4M1-R4M4 R5M1-R5M4 R6M1-R6M4 R7M1-R7M4 R10M1-R10M4 = SparkFun-Resistors:1KOHM: 1kΩ resistor A resistor is a passive two-terminal electrical component that implements electrical resistance as a circuit element. Resistors act to reduce current flow, and, at the same time, act to lower voltage levels within circuits. - Wikipedia; PROD_ID: RES-07856
1R2 1R5 1R8 1R10 1R11 = SparkFun-Resistors:1.5KOHM: 1.5kΩ resistor A resistor is a passive two-terminal electrical component that implements electrical resistance as a circuit element. Resistors act to reduce current flow, and, at the same time, act to lower voltage levels within circuits. - Wikipedia; PROD_ID: RES-08306
1R3 1R6 1R9 1R12 1R13 = SparkFun-Resistors:RESISTOR: Generic Resistor Package
1U1 = JH:LM339: Quad Comparator - LM339PWR Based on information from the SLCS006N datasheet from TI (www.ti.com). Created by nick@scantool.net, 2008. Updated 2016. SparkFun Products SparkFun OBD-II UART (WIG-09555) SparkFun Car Diagnostics Kit (RTL-10769)
1U2-1U4 = JH:CD74HC4067
3C10 3C11 = SparkFun-Capacitors:22UF: 22µF ceramic capacitors A capacitor is a passive two-terminal electrical component used to store electrical energy temporarily in an electric field.
3C12 = SparkFun-Capacitors:10NF: 0.01uF/10nF/10,000pF ceramic capacitors A capacitor is a passive two-terminal electrical component used to store electrical energy temporarily in an electric field. CAP-09321; PROD_ID: CAP-00867
3C13 C2M1-C2M4 = rcl:CPOL-US: POLARIZED CAPACITOR, American symbol; SPICEPREFIX: C
3D7 = diode:SCHOTTKY-DIODE: Schottky Diode
3L3 = JH:XAL6060
3R11 R8M1-R8M4 R9M1-R9M4 R11M1-R11M4 = SparkFun-Resistors:10KOHM: 10kΩ resistor A resistor is a passive two-terminal electrical component that implements electrical resistance as a circuit element. Resistors act to reduce current flow, and, at the same time, act to lower voltage levels within circuits. - Wikipedia; PROD_ID: RES-00824
3R12 = SparkFun-Resistors:5.62KOHM: 5.62kΩ resistor A resistor is a passive two-terminal electrical component that implements electrical resistance as a circuit element. Resistors act to reduce current flow, and, at the same time, act to lower voltage levels within circuits. - Wikipedia; PROD_ID: RES-09823; VALUE: 5.62k
4U2 = JH:TPS5450
C1M1-C1M4 = SparkFun-Capacitors:33NF: 33nF ceramic capacitors A capacitor is a passive two-terminal electrical component used to store electrical energy temporarily in an electric field.; PROD_ID: CAP-07887
D1M1-D1M4 = SparkFun-LED:LED-GREEN: Green SMD LED Used in manufacturing of various products at SparkFun Packages: 0603 - SMD 0603 package [Product Link] <http://www.futureelectronics.com/en/technologies/semiconductors/optoelectronics/leds/Pages/9894312-LTST-C190GKT.aspx?CrossPart=HSMG-C190&IM=0> LilyPad 1206 - SMD1206 LilyPad package [Product Link] <http://www.futureelectronics.com/en/Technologies/Product.aspx?ProductID=IN150NGHARVATEKCORPORATION2049943&IM=0> 1206 - SMD1206 package [Product Link] <http://www.futureelectronics.com/en/technologies/semiconductors/optoelectronics/leds/Pages/8315665-LTST-C150KGKT.aspx?IM=0> 1206 Bottom Mount -SMD 1206 Bottom Mount [Product Link] <http://www.digikey.com/product-detail/en/lite-on-inc/LTST-C230KGKT/160-1456-1-ND/386854> SparkFun Products: Pro Mini 328 -5V <https://www.sparkfun.com/products/821> RedBoard <https://www.sparkfun.com/products/12757> MP3 Trigger <https://www.sparkfun.com/products/13720> Makey Makey <https://www.sparkfun.com/products/11076>; PROD_ID: DIO-00821
D2M1-D2M4 = SparkFun-LED:LED-RED: Red SMD LED Used in manufacturing of most products at SparkFun Packages: 0603 - SMD 0603 package [Product Link] <http://docs.avagotech.com/docs/AV02-0551EN> 0603 SMART - SMD 0603 SMART package ( more efficient and expensive)[Product Link] <http://www.osram-os.com/Graphics/XPic2/00077099_0.pdf> 1206 - SMD1206 package [Product Link] <https://www.sparkfun.com/datasheets/DevTools/LilyPad/Q150OVS4.pdff> SparkFun Products: Pro Mini 328 -5V <https://www.sparkfun.com/products/821> RedBoard <https://www.sparkfun.com/products/12757> IOIO-OTG <https://www.sparkfun.com/products/13613>; PROD_ID: DIO-00819
GND = wirepad:3,17/1,1: THROUGH-HOLE PAD
IRIN1 IRIN2 LED48 LED49 = SparkFun-Connectors:CONN_03: Multi connection point. Often used as Generic Header-pin footprint for 0.1 inch spaced/style header connections On any of the 0.1 inch spaced packages, you can populate with these: Break Away Headers - Straight (PRT-00116) Break Away Male Headers - Right Angle (PRT-00553) Female Headers (PRT-00115) Break Away Headers - Machine Pin (PRT-00117) Break Away Female Headers - Swiss Machine Pin (PRT-00743) Stackable Header - 3 Pin (Female, 0.1") (PRT-13875) For SCREWTERMINALS and SPRING TERMINALS visit here: Screw Terimnals on SparkFun.com (5mm/3.5mm/2.54mm spacing) This device is also useful as a general connection point to wire up your design to another part of your project. Our various solder wires solder well into these plated through hole pads. Hook-Up Wire - Assortment (Stranded, 22 AWG) (PRT-11375) Hook-Up Wire - Assortment (Solid Core, 22 AWG) (PRT-11367) View the entire wire category on our website here Special notes: Molex polarized connector foot print use with SKU : PRT-08232 with associated crimp pins and housings.
J1 = SparkFun-Connectors:CONN_13X2: Multi connection point. Often used as Generic Header-pin footprint for 0.1 inch spaced/style header connections On any of the 0.1 inch spaced packages, you can populate with these: Break Away Headers - Straight (PRT-00116) Break Away Male Headers - Right Angle (PRT-00553) Female Headers (PRT-00115) Break Away Headers - Machine Pin (PRT-00117) Break Away Female Headers - Swiss Machine Pin (PRT-00743)
J1M1-J1M4 J2 J6 = SparkFun-Connectors:CONN_03: Multi connection point. Often used as Generic Header-pin footprint for 0.1 inch spaced/style header connections On any of the 0.1 inch spaced packages, you can populate with these: Break Away Headers - Straight (PRT-00116) Break Away Male Headers - Right Angle (PRT-00553) Female Headers (PRT-00115) Break Away Headers - Machine Pin (PRT-00117) Break Away Female Headers - Swiss Machine Pin (PRT-00743) Stackable Header - 3 Pin (Female, 0.1") (PRT-13875) For SCREWTERMINALS and SPRING TERMINALS visit here: Screw Terimnals on SparkFun.com (5mm/3.5mm/2.54mm spacing) This device is also useful as a general connection point to wire up your design to another part of your project. Our various solder wires solder well into these plated through hole pads. Hook-Up Wire - Assortment (Stranded, 22 AWG) (PRT-11375) Hook-Up Wire - Assortment (Solid Core, 22 AWG) (PRT-11367) View the entire wire category on our website here Special notes: Molex polarized connector foot print use with SKU : PRT-08232 with associated crimp pins and housings.; PROD_ID: CONN-10134; SF_SKU: PRT-08433
LED0 LED1-LED47 = JH:3528LED
PT0 PT1-PT47 = SparkFun-Sensors:LIGHT_SENSOR: Ambient Light Sensors - Phototransistors Low cost ambient light sensors, consisting of a phototransistor in miniature SMD packages. Output voltage varies with light intensity. SparkFun Products ALS-PT19 Light Sensor (SEN-12566) Ambient Light Sensor - TEMT6000 (SEN-08348) SparkFun Ambient Light Sensor Breakout - TEMT60000 (SEN-08688); PROD_ID: COMP-08569; SF_ID: COM-08348
Q1M1-Q1M4 = SparkFun-DiscreteSemi:MOSFET-NCH: N-channel MOSFETs Voltage controlled devices that allow control of high current outputs. SparkFun Products: SparkFun OpenScale <https://www.sparkfun.com/products/13261> SparkFun Digital Sandbox <https://www.sparkfun.com/products/12651> SparkFun Monster Moto Shield <https://www.sparkfun.com/products/10182> SparkFun MOSFET Power Controller <https://www.sparkfun.com/products/11214>; PROD_ID: TRANS-09984; VALUE: 35A/25V/8.5mΩ
R1M1-R1M4 R2M1-R2M4 = SparkFun-Resistors:3.3KOHM: 3.3kΩ resistor A resistor is a passive two-terminal electrical component that implements electrical resistance as a circuit element. Resistors act to reduce current flow, and, at the same time, act to lower voltage levels within circuits. - Wikipedia; PROD_ID: RES-07851
R12M1-R12M4 = SparkFun-Resistors:4.7KOHM: 4.7kΩ resistor A resistor is a passive two-terminal electrical component that implements electrical resistance as a circuit element. Resistors act to reduce current flow, and, at the same time, act to lower voltage levels within circuits. - Wikipedia; PROD_ID: RES-07857
U1M1-U1M4 = JH:VNH5019